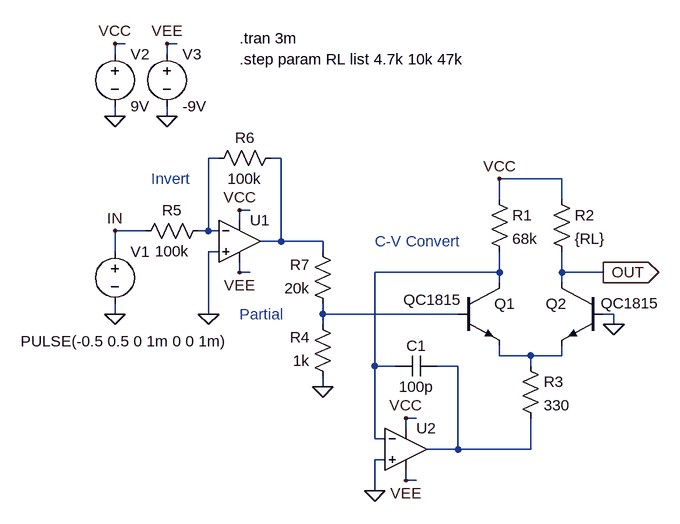
[diagram p0: schematic LadderFilter_CurrentSource_Analog2.0_2SC1815.asc]
LadderFilter_CurrentSource_Analog2.0_2SC1815.asc, the LTspice schematic file:
Version 4
SHEET 1 1028 716
WIRE 0 -112 -16 -112
WIRE 80 -112 64 -112
WIRE -16 -96 -16 -112
WIRE 64 -96 64 -112
WIRE -16 0 -16 -16
WIRE 64 0 64 -16
WIRE 144 64 128 64
WIRE 240 64 224 64
WIRE 672 96 576 96
WIRE 576 128 576 96
WIRE 672 128 672 96
WIRE 192 144 176 144
WIRE 176 160 176 144
WIRE 32 176 -16 176
WIRE 128 176 128 64
WIRE 128 176 112 176
WIRE 144 176 128 176
WIRE 240 192 240 64
WIRE 240 192 208 192
WIRE 304 192 240 192
WIRE -16 208 -16 176
WIRE 144 208 128 208
WIRE 304 208 304 192
WIRE 176 240 176 224
WIRE 192 240 176 240
WIRE 576 240 576 208
WIRE 576 240 384 240
WIRE 672 240 672 208
WIRE 736 240 672 240
WIRE 576 256 576 240
WIRE 672 256 672 240
WIRE -16 304 -16 288
WIRE 128 304 128 208
WIRE 304 304 304 288
WIRE 512 304 304 304
WIRE 752 304 736 304
WIRE 304 320 304 304
WIRE 752 320 752 304
WIRE 576 368 576 352
WIRE 624 368 576 368
WIRE 672 368 672 352
WIRE 672 368 624 368
WIRE 384 384 384 240
WIRE 416 384 384 384
WIRE 512 384 480 384
WIRE 624 384 624 368
WIRE 304 416 304 400
WIRE 448 464 432 464
WIRE 432 480 432 464
WIRE 384 496 384 384
WIRE 400 496 384 496
WIRE 512 512 512 384
WIRE 512 512 464 512
WIRE 624 512 624 464
WIRE 624 512 512 512
WIRE 400 528 384 528
WIRE 432 560 432 544
WIRE 448 560 432 560
WIRE 384 576 384 528
FLAG 752 320 0
FLAG 576 96 VCC
FLAG -16 304 0
FLAG -16 0 0
FLAG 64 0 0
FLAG -16 -112 VCC
FLAG 64 -112 VEE
FLAG -16 176 IN
FLAG 128 304 0
FLAG 176 144 VCC
FLAG 176 240 VEE
FLAG 304 416 0
FLAG 384 576 0
FLAG 432 464 VCC
FLAG 432 560 VEE
FLAG 736 240 OUT
IOPIN 736 240 Out
SYMBOL npn 512 256 R0
WINDOW 3 -84 26 Left 2
SYMATTR Value QC1815
SYMATTR InstName Q1
SYMBOL npn 736 256 M0
WINDOW 3 -86 31 Left 2
SYMATTR Value QC1815
SYMATTR InstName Q2
SYMBOL res 560 112 R0
SYMATTR InstName R1
SYMATTR Value 68k
SYMBOL res 656 112 R0
SYMATTR InstName R2
SYMATTR Value {RL}
SYMBOL res 608 368 R0
SYMATTR InstName R3
SYMATTR Value 330
SYMBOL res 320 416 R180
WINDOW 0 36 76 Left 2
WINDOW 3 36 40 Left 2
SYMATTR InstName R4
SYMATTR Value 1k
SYMBOL voltage -16 192 R0
WINDOW 3 -145 154 Left 2
WINDOW 123 0 0 Left 2
WINDOW 39 0 0 Left 2
SYMATTR Value PULSE(-0.5 0.5 0 1m 0 0 1m)
SYMATTR InstName V1
SYMBOL voltage -16 -112 R0
WINDOW 123 0 0 Left 2
WINDOW 39 0 0 Left 2
SYMATTR InstName V2
SYMATTR Value 9V
SYMBOL voltage 64 -112 R0
WINDOW 123 0 0 Left 2
WINDOW 39 0 0 Left 2
SYMATTR InstName V3
SYMATTR Value -9V
SYMBOL res 128 160 R90
WINDOW 0 0 56 VBottom 2
WINDOW 3 32 56 VTop 2
SYMATTR InstName R5
SYMATTR Value 100k
SYMBOL Opamps\\UniversalOpamp2 176 192 R0
SYMATTR InstName U1
SYMBOL res 240 48 R90
WINDOW 0 0 56 VBottom 2
WINDOW 3 32 56 VTop 2
SYMATTR InstName R6
SYMATTR Value 100k
SYMBOL res 320 304 R180
WINDOW 0 36 76 Left 2
WINDOW 3 36 40 Left 2
SYMATTR InstName R7
SYMATTR Value 20k
SYMBOL Opamps\\UniversalOpamp2 432 512 R0
SYMATTR InstName U2
SYMBOL cap 480 368 R90
WINDOW 0 0 32 VBottom 2
WINDOW 3 32 32 VTop 2
SYMATTR InstName C1
SYMATTR Value 100p
TEXT 176 -120 Left 2 !.tran 3m
TEXT 176 -88 Left 2 !.step param RL list 4.7k 10k 47k
TEXT 40 96 Left 2 ;Invert
TEXT 176 304 Left 2 ;Partial
TEXT 384 192 Left 2 ;C-V Convert

The netlist it stands for:
* LadderFilter_CurrentSource_Analog2.0_2SC1815.asc
Q1 N003 N004 N005 0 QC1815
Q2 OUT 0 N005 0 QC1815
R1 VCC N003 68k
R2 VCC OUT {RL}
R3 N005 N006 330
R4 0 N004 1k
V1 IN 0 PULSE(-0.5 0.5 0 1m 0 0 1m)
V2 VCC 0 9V
V3 VEE 0 -9V
R5 N001 IN 100k
XU1 0 N001 VCC VEE N002 level.2 Avol=1Meg GBW=10Meg Slew=10Meg ilimit=25m rail=0 Vos=0 phimargin=45 en=0 enk=0 in=0 ink=0 Rin=500Meg  ; pins IN+ IN- V+ V- OUT
R6 N002 N001 100k
R7 N004 N002 20k
XU2 0 N003 VCC VEE N006 level.2 Avol=1Meg GBW=10Meg Slew=10Meg ilimit=25m rail=0 Vos=0 phimargin=45 en=0 enk=0 in=0 ink=0 Rin=500Meg  ; pins IN+ IN- V+ V- OUT
C1 N006 N003 100p
.model NPN NPN
.model PNP PNP
.lib standard.bjt
.tran 3m
.step param RL list 4.7k 10k 47k
* Invert
* Partial
* C-V Convert
.lib UniversalOpamps2.sub
.backanno
.end